# Altium schematic sheet SCH_SO_DO_KHOI.SchDoc
size A3; SheetNumber: 2; SheetTotal: 2
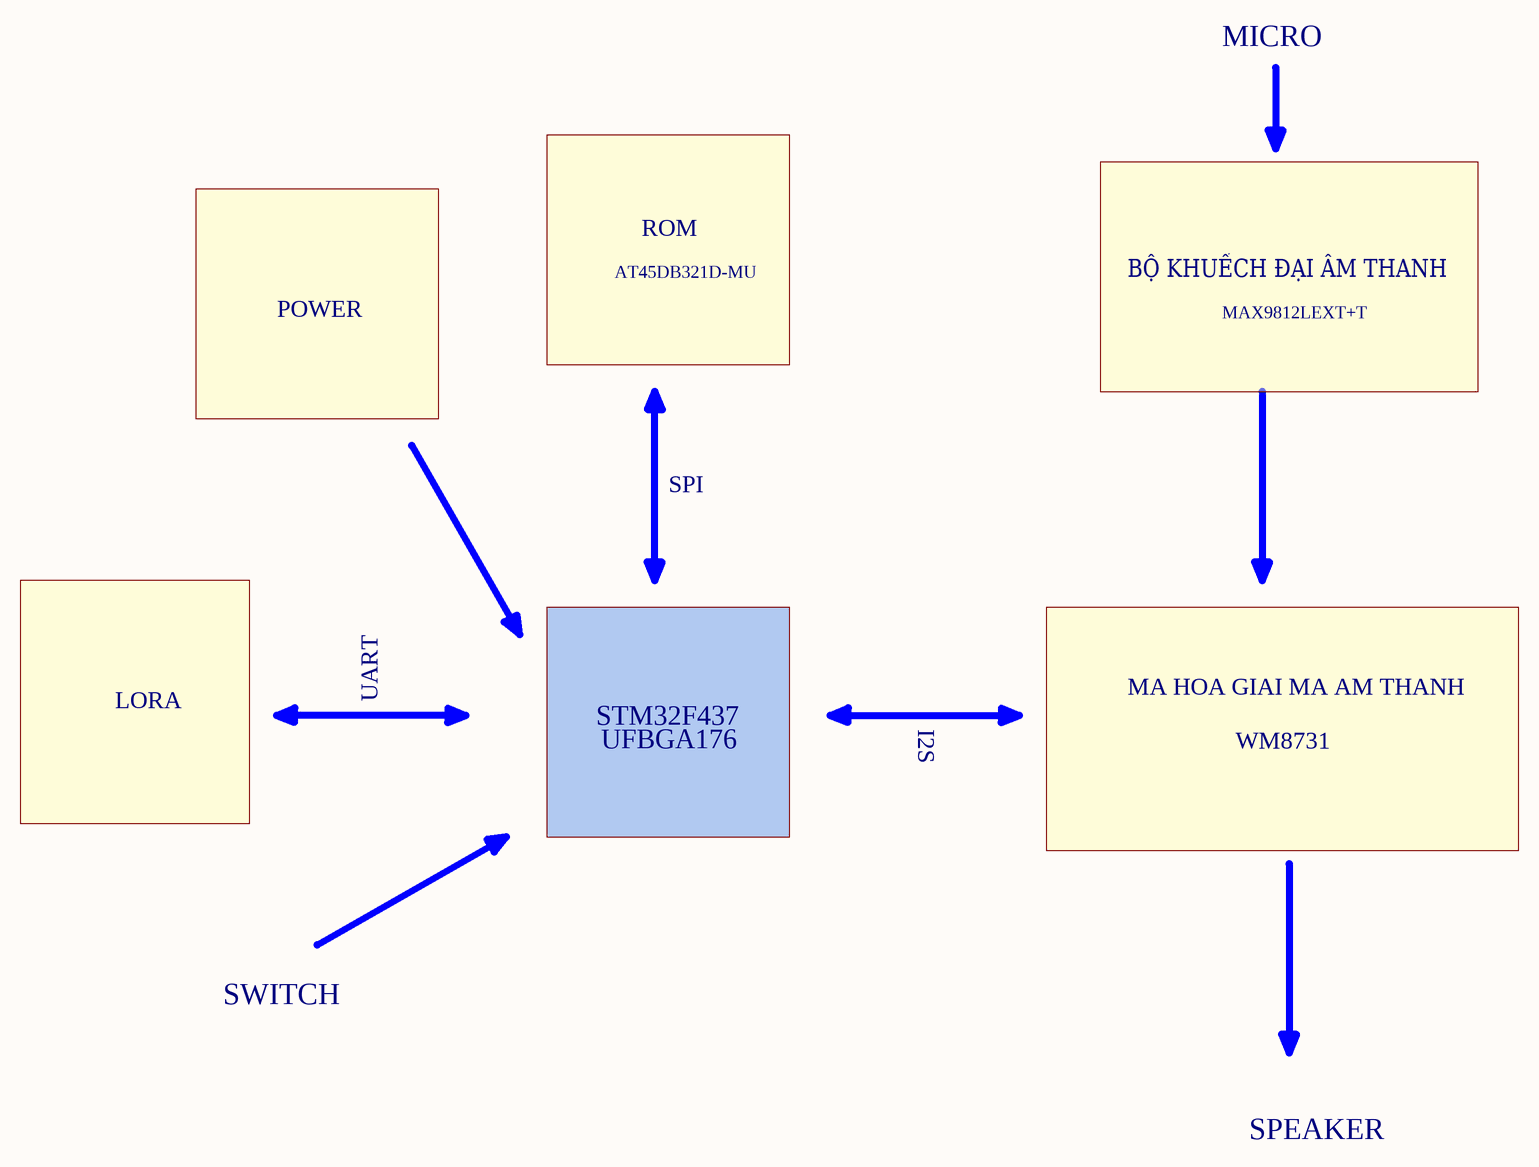
[diagram p0: SCH_SO_DO_KHOI.SchDoc]

## Notes on the sheet
- MICRO
- ROM
- POWER
- AT45DB321D-MU
- BỘ KHUẾCH ĐẠI ÂM THANH
- MAX9812LEXT+T
- SPI
- LORA
- UART
- STM32F437
- I2S
- MA HOA GIAI MA AM THANH
- UFBGA176
- WM8731
- SWITCH
- SPEAKER